# EAGLE design Soil Module (EAGLE 8.3.0)
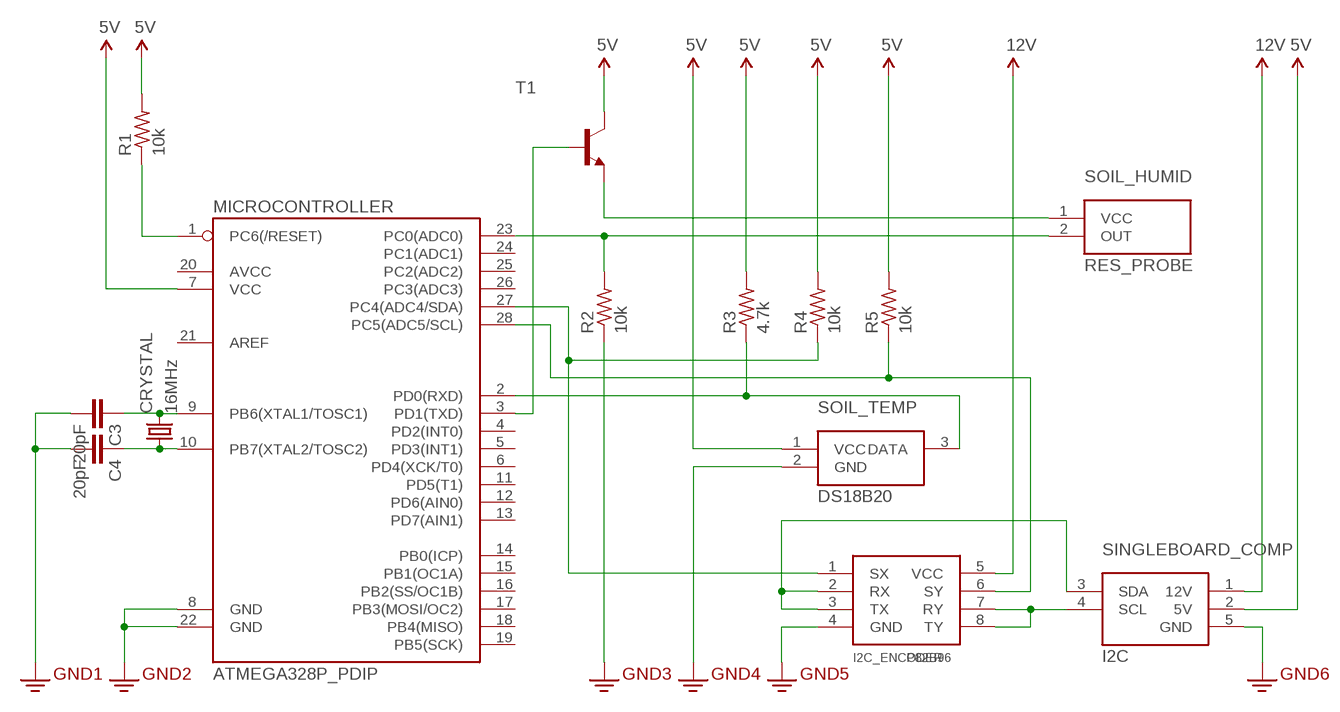
[diagram p0: schematic, sheet 1]

## Parts
C3  20pF  CAPPTH  [CAP-PTH-SMALL]
C4  20pF  CAPPTH  [CAP-PTH-SMALL]
CRYSTAL  16MHz  CRYSTALHC49US  [HC49US]
I2C_ENCODER  P82B96  [DIP08]
MICROCONTROLLER  ATMEGA328P_PDIP  [DIL28-3]
R1  10k  R-US_0204/7  [0204/7]
R2  10k  R-US_0204/7  [0204/7]
R3  4.7k  R-US_0204/7  [0204/7]
R4  10k  R-US_0204/7  [0204/7]
R5  10k  R-US_0204/7  [0204/7]
SINGLEBOARD_COMP  I2C  [I2C_TERM]
SOIL_HUMID  RES_PROBE  [SOIL_MOISTURE]
SOIL_TEMP  DS18B20  [SOIL_TEMP]
T1  2N2222A-NPN-TO18-EBC  [TO18]

## Nets
3.3V: C3.2 C4.2 I2C_ENCODER.4(GND) MICROCONTROLLER.8(GND) MICROCONTROLLER.22(GND) R2.1 SINGLEBOARD_COMP.5(GND) SOIL_TEMP.2(GND) ; supply symbol labelled GND2
5V: MICROCONTROLLER.7(VCC) R1.2 R3.2 R4.2 R5.2 SINGLEBOARD_COMP.2(5V) SOIL_TEMP.1(VCC) T1.3(C)
12V: I2C_ENCODER.5(VCC) SINGLEBOARD_COMP.1(12V)
N$1: I2C_ENCODER.6(SY) MICROCONTROLLER.28(PC5(ADC5/SCL)) R5.1
N$2: I2C_ENCODER.1(SX) MICROCONTROLLER.27(PC4(ADC4/SDA)) R4.1
N$3: I2C_ENCODER.2(RX) I2C_ENCODER.3(TX) SINGLEBOARD_COMP.3(SDA)
N$4: SOIL_HUMID.1(VCC) T1.1(E)
N$5: MICROCONTROLLER.3(PD1(TXD)) T1.2(B)
N$6: MICROCONTROLLER.2(PD0(RXD)) R3.1 SOIL_TEMP.3(DATA)
N$7: MICROCONTROLLER.23(PC0(ADC0)) R2.2 SOIL_HUMID.2(OUT)
N$13: C4.1 CRYSTAL.1 MICROCONTROLLER.10(PB7(XTAL2/TOSC2))
N$16: C3.1 CRYSTAL.2 MICROCONTROLLER.9(PB6(XTAL1/TOSC1))
N$22: MICROCONTROLLER.1(PC6(/RESET)) R1.1
N$28: I2C_ENCODER.7(RY) I2C_ENCODER.8(TY) SINGLEBOARD_COMP.4(SCL)
Unconnected: MICROCONTROLLER.4(PD2(INT0)) MICROCONTROLLER.5(PD3(INT1)) MICROCONTROLLER.6(PD4(XCK/T0)) MICROCONTROLLER.11(PD5(T1)) MICROCONTROLLER.12(PD6(AIN0)) MICROCONTROLLER.13(PD7(AIN1)) MICROCONTROLLER.14(PB0(ICP)) MICROCONTROLLER.15(PB1(OC1A)) MICROCONTROLLER.16(PB2(SS/OC1B)) MICROCONTROLLER.17(PB3(MOSI/OC2)) MICROCONTROLLER.18(PB4(MISO)) MICROCONTROLLER.19(PB5(SCK)) MICROCONTROLLER.20(AVCC) MICROCONTROLLER.21(AREF) MICROCONTROLLER.24(PC1(ADC1)) MICROCONTROLLER.25(PC2(ADC2)) MICROCONTROLLER.26(PC3(ADC3))

## Library data of the parts
C3 C4 = SparkFun-Capacitors:CAP: Capacitor Standard 0603 ceramic capacitor, and 0.1" leaded capacitor.
CRYSTAL = SparkFun-FreqCtrl:CRYSTAL: Various standard crystals. Proven footprints.
I2C_ENCODER = 003_P82B96:P82B96: P82B96 - I2C buffer
MICROCONTROLLER = SparkFun-DigitalIC:ATMEGA328P_PDIP: uC used in the Arduino 32kb flash, 1k EEPROM, 2k SRAM This is the through-hole version of this chip.
R1-R5 = resistor:R-US_: RESISTOR, American symbol
SINGLEBOARD_COMP = 000_CropQuant:I2C
SOIL_HUMID = 000_CropQuant:RES_PROBE
SOIL_TEMP = 000_CropQuant:DS18B20
T1 = transistor:*-NPN-: NPN Transistror BF959 corrected 2008.03.06

## Board
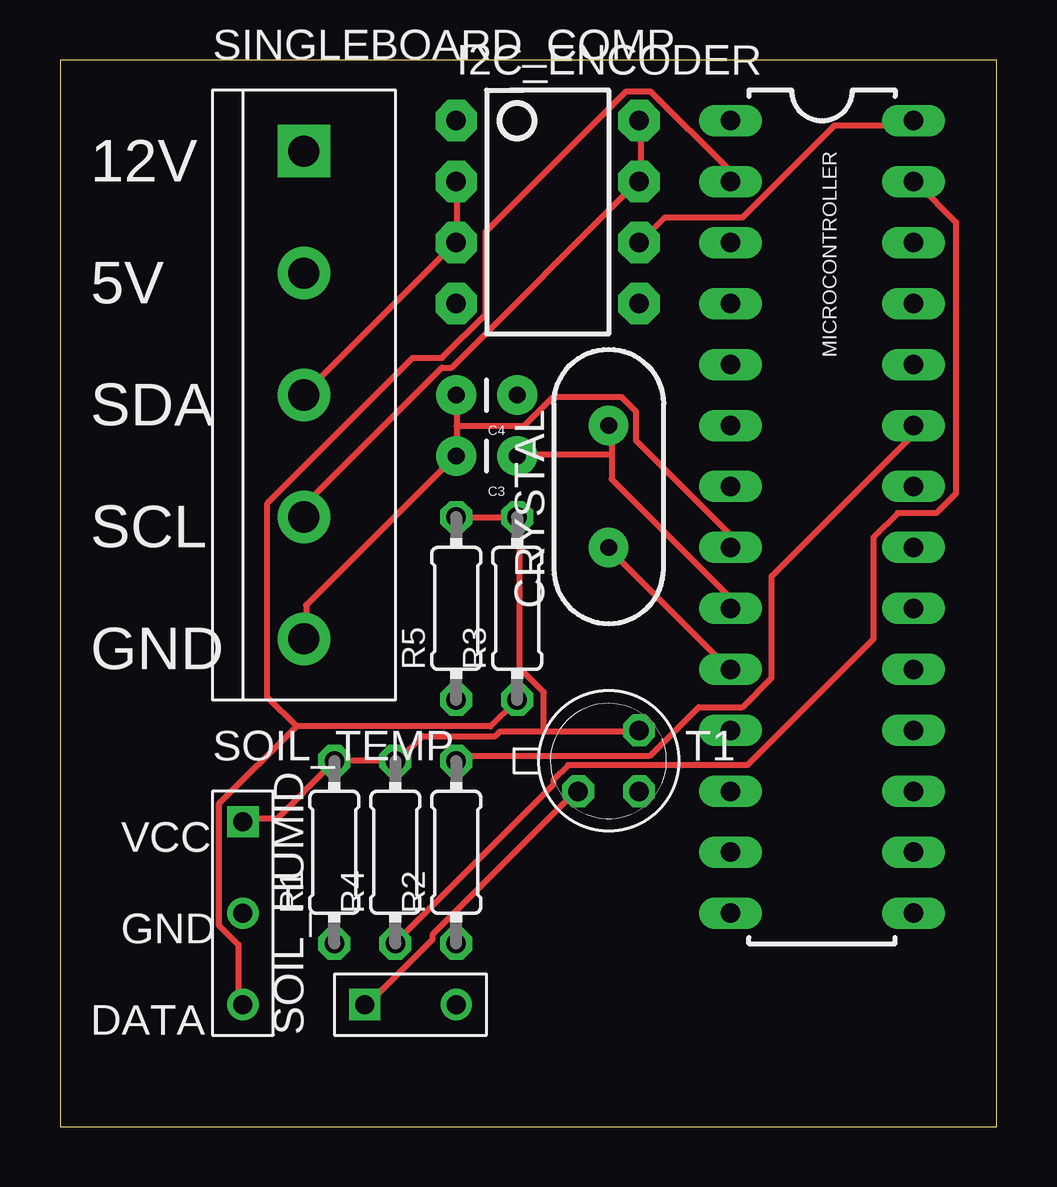
[diagram p1: board, top side]
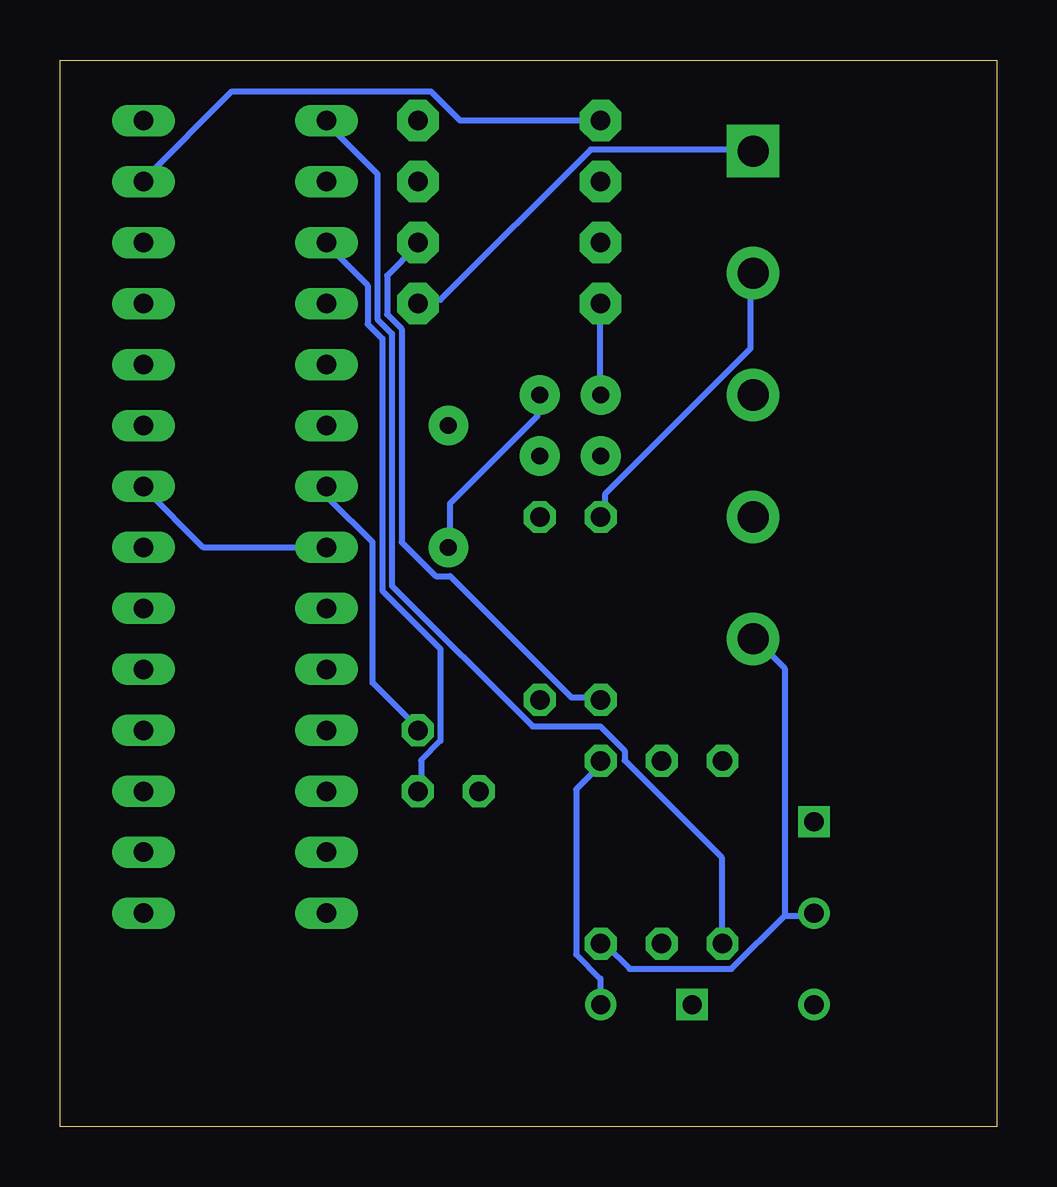
[diagram p2: board, bottom side, seen from below]

Size 39.04 x 44.44 mm. Coordinates in mm from the lower left corner, seen from the top.
Outline: 0,0 39.04,0 39.04,44.44 0,44.44 0,0
Copper layers (1*16): Top 0.035mm / dielectric 1.5mm / Bottom 0.035mm
Design rules "default *": minimum track width 10mil, minimum drill 24mil, track to track 0.15mm, track to pad 0.15mm, pad to pad 0.15mm, via to via 0.15mm, smd to smd 0.15mm, copper to edge 40mil, drill to drill 8mil, minimum pad ring 10mil, minimum via ring 8mil, stop-mask expansion 4mil, vias tented up to drill 0mil, thermal gap 10mil

### Footprints (pad centres in the part's own frame; a part is rotated, then mirrored left to right if it is on the bottom)
CAP-PTH-SMALL = drill 0.7 pad 1.651: 1 0,0; 2 2.54,0
HC49US = drill 0.7 pad 1.651: 1 -2.54,0; 2 2.54,0
DIP08 = drill 0.813 pad 1.727 octagon: 1 -3.81,-3.81; 2 -1.27,-3.81; 3 1.27,-3.81; 4 3.81,-3.81; 5 3.81,3.81; 6 1.27,3.81; 7 -1.27,3.81; 8 -3.81,3.81
DIL28-3 = drill 0.813 long: 1 -16.51,-3.81; 2 -13.97,-3.81; 3 -11.43,-3.81; 4 -8.89,-3.81; 5 -6.35,-3.81; 6 -3.81,-3.81; 7 -1.27,-3.81; 8 1.27,-3.81; 9 3.81,-3.81; 10 6.35,-3.81; 11 8.89,-3.81; 12 11.43,-3.81; 13 13.97,-3.81; 14 16.51,-3.81; 15 16.51,3.81; 16 13.97,3.81; 17 11.43,3.81; 18 8.89,3.81; 19 6.35,3.81; 20 3.81,3.81; 21 1.27,3.81; 22 -1.27,3.81; 23 -3.81,3.81; 24 -6.35,3.81; 25 -8.89,3.81; 26 -11.43,3.81; 27 -13.97,3.81; 28 -16.51,3.81
0204/7 = drill 0.813 octagon: 1 -3.81,0; 2 3.81,0
I2C_TERM = drill 1.3 pad 2.184 square: 1 0,10.16 | drill 1.3 pad 2.184: 2 0,5.08; 3 0,0; 4 0,-5.08; 5 0,-10.16
SOIL_MOISTURE = drill 0.8 square: 1 0,1.27 | drill 0.8: 2 0,-2.54
SOIL_TEMP = drill 0.8 square: 1 0,3.81 | drill 0.8: 2 0,0; 3 0,-3.81
TO18 = drill 0.813 octagon: 1 -1.27,-1.27; 2 1.27,-1.27; 3 1.27,1.27

### Placement (x,y rotation side)
C3  19.05,27.94 180 top
C4  19.05,30.48 180 top
CRYSTAL  22.86,26.67 90 top
I2C_ENCODER  20.32,38.1 270 top
MICROCONTROLLER  31.75,25.4 270 top
R1  11.43,11.43 90 top
R2  16.51,11.43 90 top
R3  19.05,21.59 90 top
R4  13.97,11.43 90 top
R5  16.51,21.59 90 top
SINGLEBOARD_COMP  10.16,30.48 0 top
SOIL_HUMID  13.97,5.08 90 top
SOIL_TEMP  7.62,8.89 0 top
T1  22.86,15.24 0 top

### Tracks (layer width: path | path; a pad name or v marks a point on that pad's centre or on a via)
3.3V
  Top 0.254: 16.52,29.2 16.52,30.41 C4.2 | 16.52,29.2 16.52,27.98 C3.2 16.32,27.78 10.26,21.72 10.26,20.51 SINGLEBOARD_COMP.5 | 16.52,29.2 19.35,29.2 20.56,30.41 23.39,30.41 24,29.8 24,28.59 27.83,24.75 27.83,24.15 MICROCONTROLLER.8
  Bottom 0.254: MICROCONTROLLER.8 28.04,24.15 33.09,24.15 35.51,26.57 MICROCONTROLLER.22 | 8.85,8.79 7.63,8.79 SOIL_TEMP.2 | 8.85,8.79 11.07,6.57 15.31,6.57 16.32,7.58 R2.1 | I2C_ENCODER.4 16.52,34.25 16.52,30.61 C4.2 | 8.85,8.79 8.85,19.1 10.06,20.31 SINGLEBOARD_COMP.5
5V
  Top 0.254: R5.2 16.52,25.36 18.95,25.36 R3.2 19.15,25.36 19.15,19.1 20.16,18.09 20.16,16.47 | SOIL_TEMP.1 7.63,12.83 9.05,12.83 11.27,15.06 R1.2 11.47,15.26 13.9,15.26 R4.2 14.1,15.26 15.11,16.27 18.14,16.27 18.34,16.47 20.16,16.47 | 20.16,16.47 24,16.47 T1.3
  Bottom 0.254: MICROCONTROLLER.7 27.83,26.57 27.83,26.17 26.02,24.35 26.02,18.49 24.2,16.67 T1.3 | SINGLEBOARD_COMP.2 10.26,35.46 10.26,32.43 16.32,26.37 16.32,25.56 R5.2
12V
  Bottom 0.254: I2C_ENCODER.5 24,34.45 23.19,34.45 16.93,40.71 10.26,40.71 SINGLEBOARD_COMP.1
N$1
  Top 0.254: MICROCONTROLLER.28 35.51,41.72 32.28,41.72 28.44,37.88 25.21,37.88 24.2,36.87 I2C_ENCODER.6
  Bottom 0.254: R5.1 16.52,17.88 17.73,17.88 22.78,22.93 23.39,22.93 24.8,24.35 24.8,33.24 25.41,33.84 25.41,35.46 24.2,36.67 I2C_ENCODER.6
N$2
  Top 0.254: R4.1 14.1,7.78 20.56,14.25 20.56,14.45 21.17,15.06 28.64,15.06 33.89,20.31 33.89,24.55 34.9,25.56 36.52,25.56 37.33,26.37 37.33,37.68 35.71,39.3 MICROCONTROLLER.27
  Bottom 0.254: I2C_ENCODER.1 16.52,41.92 22.38,41.92 23.59,43.13 31.87,43.13 35.51,39.5 MICROCONTROLLER.27
N$3
  Top 0.254: I2C_ENCODER.2 16.52,39.3 16.52,36.87 I2C_ENCODER.3 16.32,36.67 10.26,30.61 SINGLEBOARD_COMP.3
N$4
  Top 0.254: SOIL_HUMID.1 12.89,5.16 15.51,7.78 15.51,7.99 21.57,14.05 T1.1
N$5
  Bottom 0.254: T1.2 24,14.05 24,15.26 23.19,16.07 23.19,19.9 25.61,22.33 25.61,32.83 26.22,33.44 26.22,35.05 27.83,36.67 MICROCONTROLLER.3
N$6
  Top 0.254: 9.86,16.67 6.62,13.44 6.62,8.39 7.43,7.58 7.43,5.16 SOIL_TEMP.3 | 9.86,16.67 17.94,16.67 18.95,17.68 R3.1 | 9.86,16.67 8.64,17.88 8.64,25.96 14.7,32.02 15.92,32.02 17.73,33.84 17.73,37.28 23.59,43.13 24.6,43.13 27.83,39.9 27.83,39.5 MICROCONTROLLER.2
N$7
  Top 0.254: MICROCONTROLLER.23 35.51,29.2 35.51,28.79 29.65,22.93 29.65,18.69 28.44,17.48 26.62,17.48 24.6,15.46 16.72,15.46 16.52,15.26 R2.2
  Bottom 0.254: SOIL_HUMID.2 16.52,5.16 16.52,6.17 17.53,7.18 17.53,14.05 16.52,15.06 R2.2
N$13
  Top 0.254: MICROCONTROLLER.10 27.83,19.1 22.99,23.94 CRYSTAL.1
  Bottom 0.254: C4.1 19.15,30.41 19.15,29.6 22.78,25.96 22.78,24.15 CRYSTAL.1
N$16
  Top 0.254: 22.99,27.98 22.99,29.2 CRYSTAL.2 | 22.99,27.98 22.99,26.97 27.83,22.13 27.83,21.72 MICROCONTROLLER.9 | 22.99,27.98 19.15,27.98 C3.1
N$22
  Bottom 0.254: R1.1 11.47,7.78 11.47,11.22 15.51,15.26 15.51,15.66 16.52,16.67 19.35,16.67 25.21,22.53 25.21,33.03 25.81,33.64 25.81,39.7 27.83,41.72 MICROCONTROLLER.1
N$28
  Top 0.254: I2C_ENCODER.8 24.2,41.72 24.2,39.5 I2C_ENCODER.7 24,39.3 16.32,31.62 15.92,31.62 10.26,25.96 10.26,25.56 SINGLEBOARD_COMP.4